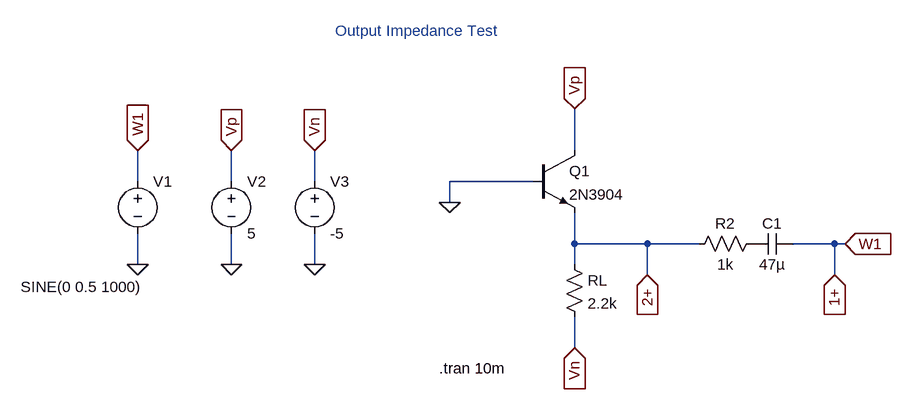
[diagram p0: schematic out_imp_bjt.asc]
out_imp_bjt.asc, the LTspice schematic file:
Version 4
SHEET 1 880 680
WIRE 80 -64 80 -128
WIRE -592 -16 -592 -64
WIRE -448 -16 -448 -64
WIRE -320 -16 -320 -64
WIRE 16 -16 -112 -16
WIRE -112 16 -112 -16
WIRE 80 80 80 32
WIRE 192 80 80 80
WIRE 272 80 192 80
WIRE 480 80 416 80
WIRE 496 80 480 80
WIRE -592 112 -592 64
WIRE -448 112 -448 64
WIRE -320 112 -320 64
WIRE 80 112 80 80
WIRE 192 128 192 80
WIRE 480 128 480 80
WIRE 80 240 80 192
FLAG 80 -128 Vp
IOPIN 80 -128 In
FLAG -592 112 0
FLAG -448 112 0
FLAG -320 112 0
FLAG -592 -64 W1
IOPIN -592 -64 In
FLAG -448 -64 Vp
IOPIN -448 -64 In
FLAG -320 -64 Vn
IOPIN -320 -64 In
FLAG 80 240 Vn
IOPIN 80 240 In
FLAG 496 80 W1
IOPIN 496 80 In
FLAG -112 16 0
FLAG 192 128 2+
IOPIN 192 128 In
FLAG 480 128 1+
IOPIN 480 128 In
SYMBOL npn 16 -64 R0
SYMATTR InstName Q1
SYMATTR Value 2N3904
SYMBOL voltage -592 -32 R0
WINDOW 3 -180 178 Left 2
WINDOW 123 0 0 Left 0
WINDOW 39 0 0 Left 0
SYMATTR Value SINE(0 0.5 1000)
SYMATTR InstName V1
SYMBOL voltage -448 -32 R0
WINDOW 123 0 0 Left 0
WINDOW 39 0 0 Left 0
SYMATTR InstName V2
SYMATTR Value 5
SYMBOL voltage -320 -32 R0
WINDOW 123 0 0 Left 0
WINDOW 39 0 0 Left 0
SYMATTR InstName V3
SYMATTR Value -5
SYMBOL res 64 96 R0
SYMATTR InstName RL
SYMATTR Value 2.2k
SYMBOL res 368 64 R90
WINDOW 0 0 56 VBottom 2
WINDOW 3 32 56 VTop 2
SYMATTR InstName R2
SYMATTR Value 1k
SYMBOL cap 416 64 R90
WINDOW 0 0 32 VBottom 2
WINDOW 3 32 32 VTop 2
SYMATTR InstName C1
SYMATTR Value 47µ
TEXT -128 272 Left 2 !.tran 10m
TEXT -288 -248 Left 2 ;Output Impedance Test

The netlist it stands for:
* out_imp_bjt.asc
Q1 Vp 0 2+ 0 2N3904
V1 1+ 0 SINE(0 0.5 1000)
V2 Vp 0 5
V3 Vn 0 -5
RL 2+ Vn 2.2k
R2 P001 2+ 1k
C1 1+ P001 47µ
.model NPN NPN
.model PNP PNP
.lib standard.bjt
.tran 10m
* Output Impedance Test
.backanno
.end